# Altium schematic sheet 1_P1.schdoc.schdoc
size 309 x 223 mm; Symbol: Sheet-Symbol_A4; Device: Sheet-Symbol_A4; Company: 嘉立创EDA; Version: V1.0; Page Size: A4; @Project Name: buck电路; @Page Count: 1; @Update Date: 2024-04-19; @Create Date: 2024-04-19; @Schematic Name: Schematic1; @Page No: 1; @Page Name: P1
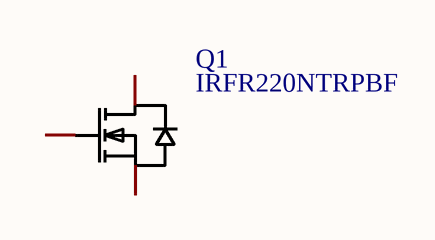
[diagram p0: 1_P1.schdoc.schdoc]

## Parts
Q1  IRFR220NTRPBF  [TO-252-2_L6.6-W6.1-P4.57-LS9.9-TR-CW]

## Nets

Not connected (* = marked no-connect by the designer): Q1 1(G) 2(D) 3(S)

## Notes on the sheet
- 1
- 2
- 3
- 4
- 5
- 6
- A
- B
- C
- 原理图
- Schematic1
- 创建日期
- 更新日期
- 2024-04-19
- 审阅
- 绘制
- 图页
- P1
- 物料编码
- buck电路
- D
- 版本
- 尺寸
- 页
- 共
- V1.0
- A4
- 嘉立创EDA

## Library data of the parts
Q1 = IRFR220NTRPBF: Manufacturer: Infineon(英飞凌); Add into BOM: yes; Type: 1个N沟道; Drain Source Voltage (Vdss): 200V; Continuous Drain Current (Id): 5A; Power Dissipation (Pd): 43W; Drain Source On Resistance (RDS(on)@Vgs,Id): 600mΩ@10V,2.9A; Gate Threshold Voltage (Vgs(th)@Id): 4V@250uA; Total Gate Charge (Qg@Vgs): 23nC@10V; Input Capacitance (Ciss@Vds): 300pF@25V; Description: 类型:1个N沟道;漏源电压(Vdss):200V;连续漏极电流(Id):5A;功率(Pd):43W;导通电阻(RDS(on)@Vgs,Id):600mΩ@10V,2.9A;阈值电压(Vgs(th)@Id):4V@250uA;; Name: IRFR220NTRPBF; Symbol: IRFR220N; Device: IRFR220NTRPBF; LCSC Part Name: 1个N沟道 耐压:200V 电流:5A; Supplier Part: C2584; Manufacturer Part: IRFR220NTRPBF; Supplier Footprint: TO-252-2(DPAK); Datasheet: https://atta.szlcsc.com/upload/public/pdf/source/20200323/C500528_AD38F318A115118F4DB56F5A4EA6919E.pdf; Supplier: LCSC; Convert to PCB: yes; Operating Temperature: -55℃~+175℃@(Tj)